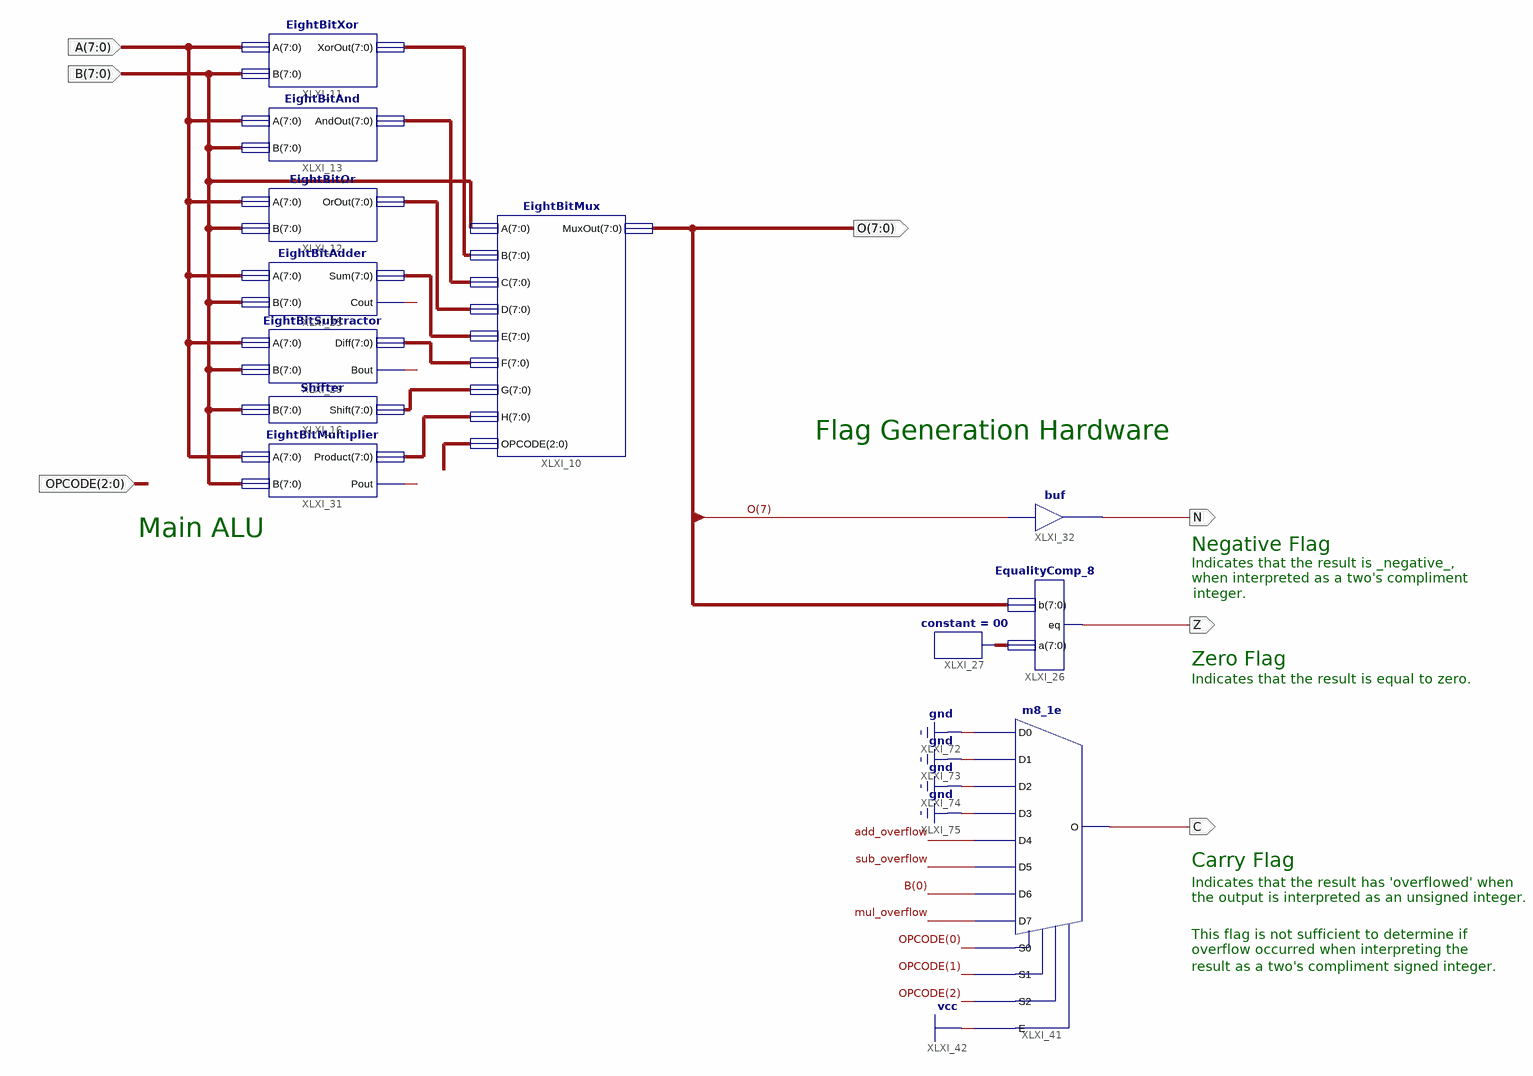
[diagram p0: schematic sheet 1]
// Xilinx ISE schematic ALU.sch (spartan6) as structural Verilog: 12 symbols, 7 ports
module ALU (
  input  [7:0] B,
  input  [7:0] A,
  input  [2:0] OPCODE,
  output [7:0] O,
  output C,
  output Z,
  output N
);

  wire add_overflow, mul_overflow, sub_overflow;
  wire [7:0] XLXN_46, XLXN_48, XLXN_55, XLXN_61, XLXN_62, XLXN_65, XLXN_70, XLXN_209;

  EqualityComp_8 XLXI_26 (.a(XLXN_55), .b(O), .eq(Z));
  constant #(.CValue("00")) XLXI_27 (.O(XLXN_55));
  m8_1e XLXI_41 (
    .D0(1'b0), .D1(1'b0), .D2(1'b0), .D3(1'b0), .D4(add_overflow), .D5(sub_overflow), .D6(B[0]),
    .D7(mul_overflow), .E(1'b1), .S0(OPCODE[0]), .S1(OPCODE[1]), .S2(OPCODE[2]), .O(C));
  buf XLXI_32 (N, O[7]);
  EightBitXor XLXI_11 (.A(A), .B(B), .XorOut(XLXN_48));
  EightBitAnd XLXI_13 (.A(A), .B(B), .AndOut(XLXN_61));
  EightBitOr XLXI_12 (.A(A), .B(B), .OrOut(XLXN_62));
  EightBitSubtractor XLXI_29 (.A(A), .B(B), .Diff(XLXN_46), .Bout(sub_overflow));
  Shifter XLXI_16 (.B(B), .Shift(XLXN_65));
  EightBitMultiplier XLXI_31 (.A(A), .B(B), .Product(XLXN_70), .Pout(mul_overflow));
  EightBitMux XLXI_10 (
    .A(B), .B(XLXN_48), .MuxOut(O), .C(XLXN_61), .D(XLXN_62), .E(XLXN_209), .F(XLXN_46), .G(XLXN_65),
    .H(XLXN_70), .OPCODE(OPCODE));
  EightBitAdder XLXI_25 (.A(A), .B(B), .Sum(XLXN_209), .Cout(add_overflow));

  // Notes on the sheet:
  //   Flag Generation Hardware
  //   Main ALU
  //   Negative Flag
  //   Indicates that the result is _negative_,
  //   when interpreted as a two's compliment
  //   integer.
  //   Zero Flag
  //   Indicates that the result is equal to zero.
  //   Carry Flag
  //   Indicates that the result has 'overflowed' when
  //   the output is interpreted as an unsigned integer.
  //   This flag is not sufficient to determine if
  //   overflow occurred when interpreting the
  //   result as a two's compliment signed integer.
endmodule
